# EAGLE design atx_power_control (EAGLE 9.6.1)
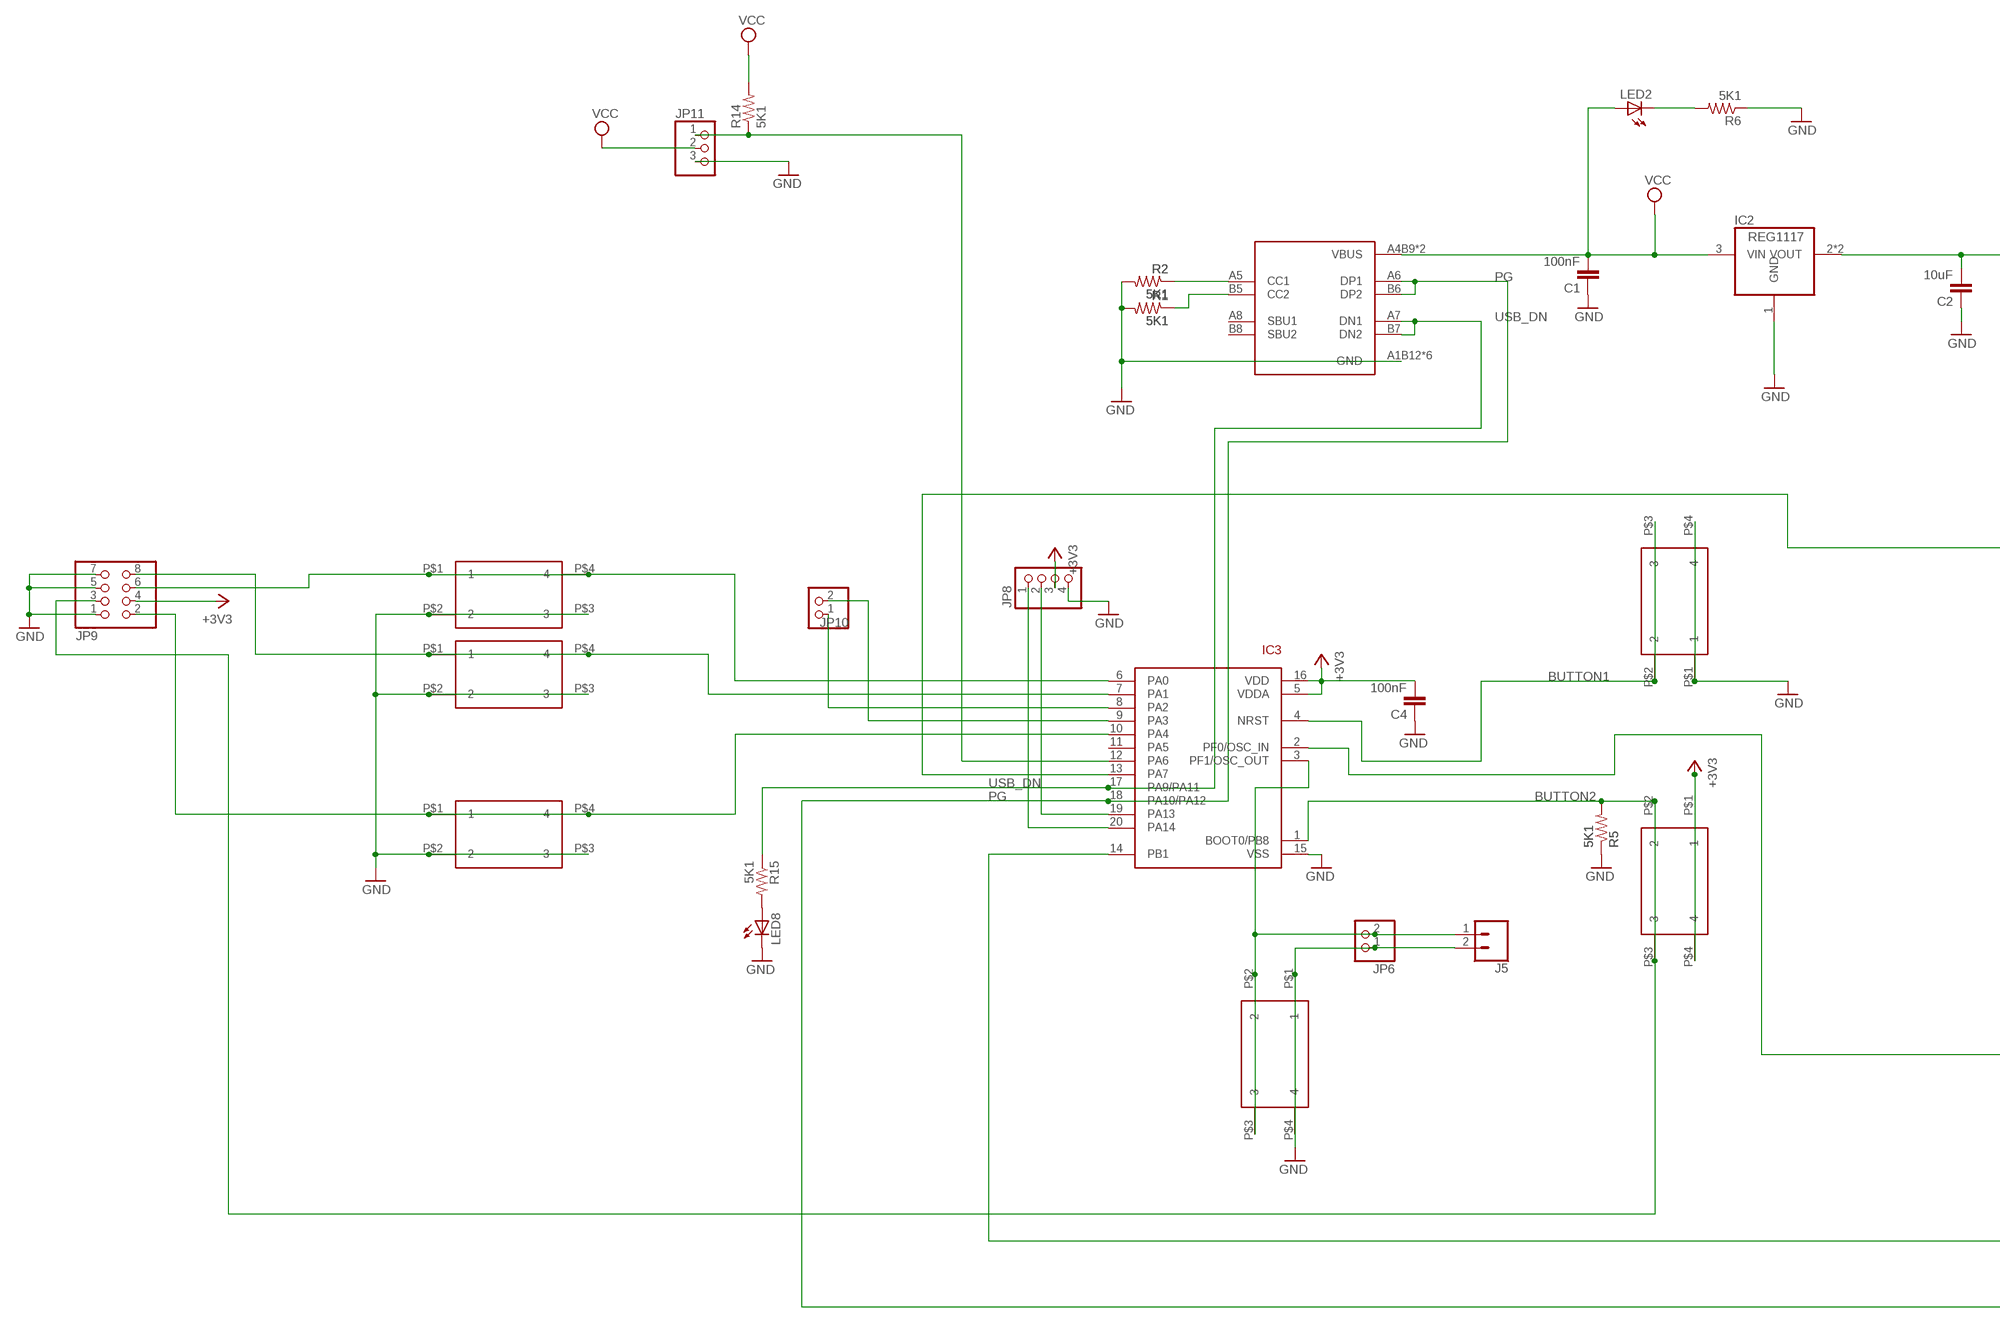
[diagram p0: schematic, sheet 1, part 1 of 2]
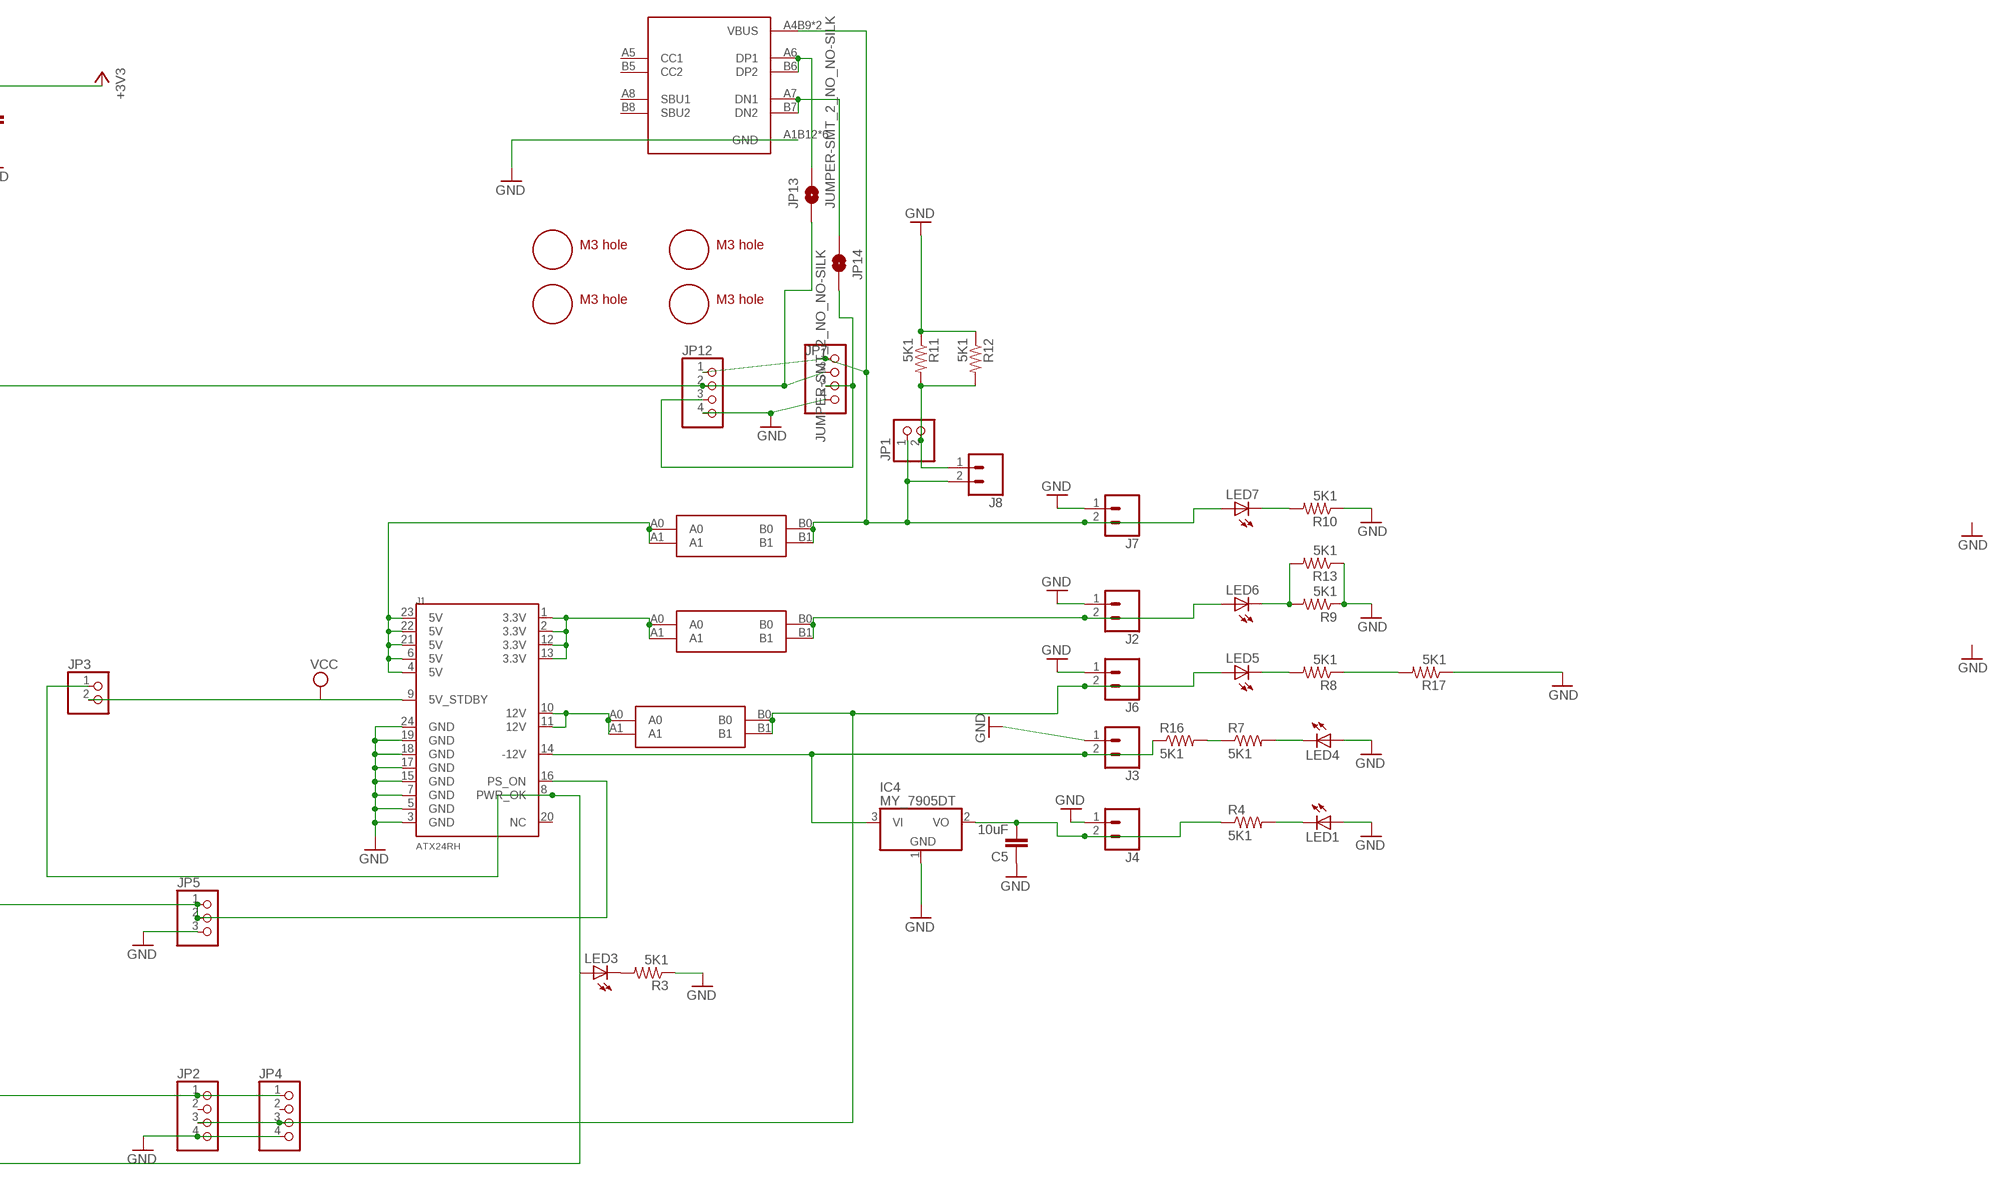
[diagram p1: schematic, sheet 1, part 2 of 2]

## Parts
C1  100nF  CAP0805  [0805$1]
C2  10uF  CAP0805  [0805$1]
C4  100nF  CAP0805  [0805$1]
C5  10uF  CAP0805  [0805$1]
IC2  REG1117  [SOT223]
IC3  STM32F042F4  [TSSOP20]
IC4  MY_7905DT  [ADAFRUIT_TO252]
J1  ATX24RH  [ATX24_RIGHT_ANGLE]
J2  CONN_023.5MM  [SCREWTERMINAL-3.5MM-2]
J3  CONN_023.5MM  [SCREWTERMINAL-3.5MM-2]
J4  CONN_023.5MM  [SCREWTERMINAL-3.5MM-2]
J5  CONN_023.5MM  [SCREWTERMINAL-3.5MM-2]
J6  CONN_023.5MM  [SCREWTERMINAL-3.5MM-2]
J7  CONN_023.5MM-NO_SILK  [SCREWTERMINAL-3.5MM-2-NS]
J8  CONN_023.5MM  [SCREWTERMINAL-3.5MM-2]
JP1  PINHD-1X2  [1X02]
JP2  PINHD-1X4  [1X04]
JP3  PINHD-1X2  [1X02]
JP4  PINHD-1X4  [1X04]
JP5  PINHD-1X3:1  [1X03]
JP6  PINHD-1X2  [1X02]
JP7  PINHD-1X6  [1X06]
JP8  PINHD-1X4  [1X04]
JP9  PINHD-2X4  [2X04]
JP10  PINHD-1X2  [1X02]
JP11  PINHD-1X3CB  [1X03-CLEANBIG]
JP12  PINHD-1X6  [1X06]
JP13  JUMPER-SMT_2_NO_NO-SILK  [SMT-JUMPER_2_NO_NO-SILK]
JP14  JUMPER-SMT_2_NO_NO-SILK  [SMT-JUMPER_2_NO_NO-SILK]
LED1  LEDCHIP-LED0805  [CHIP-LED0805]
LED2  LEDCHIP-LED0805  [CHIP-LED0805]
LED3  LEDCHIP-LED0805  [CHIP-LED0805]
LED4  LEDCHIP-LED0805  [CHIP-LED0805]
LED5  LEDCHIP-LED0805  [CHIP-LED0805]
LED6  LEDCHIP-LED0805  [CHIP-LED0805]
LED7  LEDCHIP-LED0805  [CHIP-LED0805]
LED8  LEDCHIP-LED0805  [CHIP-LED0805]
R1  5K1  RESISTOR0805-RES  [0805]
R2  5K1  RESISTOR0805-RES  [0805]
R3  5K1  RESISTOR0805-RES  [0805]
R4  5K1  RESISTOR0805-RES  [0805]
R5  5K1  RESISTOR0805-RES  [0805]
R6  5K1  RESISTOR0805-RES  [0805]
R7  5K1  RESISTOR0805-RES  [0805]
R8  5K1  RESISTOR0805-RES  [0805]
R9  5K1  RESISTOR0805-RES  [0805]
R10  5K1  RESISTOR0805-RES  [0805]
R11  5K1  RESISTOR0805-RES  [0805]
R12  5K1  RESISTOR0805-RES  [0805]
R13  5K1  RESISTOR0805-RES  [0805]
R14  5K1  RESISTOR0805-RES  [0805]
R15  5K1  RESISTOR0805-RES  [0805]
R16  5K1  RESISTOR0805-RES  [0805]
R17  5K1  RESISTOR0805-RES  [0805]
SW1  324_SW  [342_SWICH_FOOT]
SW2  324_SW  [342_SWICH_FOOT]
SW3  324_SW  [342_SWICH_FOOT]
SW4  324_SW  [342_SWICH_FOOT]
SW5  324_SW  [342_SWICH_FOOT]
SW7  324_SW  [342_SWICH_FOOT]
U1  USBC_16P  [USBC_16P_FOOT]
U2  USBC_16P  [USBC_16P_FOOT]
U$1  M3_MOUNTING_HOLE  [M3_MOUNTING_HOLE_PACK]
U$2  M3_MOUNTING_HOLE  [M3_MOUNTING_HOLE_PACK]
U$3  M3_MOUNTING_HOLE  [M3_MOUNTING_HOLE_PACK]
U$5  CAR_FUSE_HOLDER3IN1  [FUSE_HOLDER_3IN1]
U$7  CAR_FUSE_HOLDER3IN1  [FUSE_HOLDER_3IN1]
U$8  CAR_FUSE_HOLDER3IN1  [FUSE_HOLDER_3IN1]
U$10  M3_MOUNTING_HOLE  [M3_MOUNTING_HOLE_PACK]

## Nets
+3V3: C2.2 C4.2 IC2.2(VOUT) IC2.4(VOUT) IC3.5(VDDA) IC3.16(VDD) JP8.3 JP9.4 SW4.P$1 SW4.P$4
BUTTON1: IC3.4(NRST) SW3.P$2 SW3.P$3
BUTTON2: IC3.1(BOOT0/PB8) JP9.3 R5.2 SW4.P$2 SW4.P$3
GND: C1.1 C2.1 C4.1 C5.1 IC2.1(GND) IC3.15(VSS) IC4.1(GND) J1.3(GND) J1.5(GND) J1.7(GND) J1.15(GND) J1.17(GND) J1.18(GND) J1.19(GND) J1.24(GND) J2.1 J3.1 J4.1 J5.2 J6.1 J7.1 JP2.4 JP4.4 JP5.3 JP6.1 JP7.4 JP8.4 JP9.1 JP9.5 JP9.7 JP11.3 JP12.4 LED1.A LED4.A LED8.C R1.2 R2.2 R3.1 R5.1 R6.1 R9.1 R10.1 R11.1 R12.1 R13.1 R17.1 SW1.P$1 SW1.P$4 SW2.P$2 SW2.P$3 SW3.P$1 SW3.P$4 SW5.P$2 SW5.P$3 SW7.P$2 SW7.P$3 U1.A1B12(GND) U1.B11A12(GND) U1.P$13(GND) U1.P$14(GND) U1.P$15(GND) U1.P$16(GND) U2.A1B12(GND) U2.B11A12(GND) U2.P$13(GND) U2.P$14(GND) U2.P$15(GND) U2.P$16(GND)
N$1: LED3.C R3.2
N$2: IC4.3(VI) J1.14(-12V) J3.2 R16.1
N$3: IC3.20(PA14) JP8.1
N$4: IC3.19(PA13) JP8.2
N$5: LED1.C R4.2
N$6: IC3.12(PA6) JP11.1 R14.1
N$7: IC3.14(PB1) JP2.1 JP4.1
N$8: LED4.C R7.2
N$9: LED5.C R8.2
N$10: J1.4(5V) J1.6(5V) J1.21(5V) J1.22(5V) J1.23(5V) U$8.A0 U$8.A1
N$11: C5.2 IC4.2(VO) J4.2 R4.1
N$12: IC3.9(PA3) JP10.2
N$13: IC3.6(PA0) JP9.6 SW2.P$1 SW2.P$4
N$14: J1.1(3.3V) J1.2(3.3V) J1.12(3.3V) J1.13(3.3V) U$7.A0 U$7.A1
N$15: J6.2 JP2.3 JP4.3 LED5.A U$5.B0 U$5.B1
N$16: J2.2 LED6.A U$7.B0 U$7.B1
N$17: J8.1 JP1.2 R11.2 R12.2
N$18: LED6.C R9.2 R13.2
N$19: LED8.A R15.2
N$20: LED7.C R10.2
N$21: J1.10(12V) J1.11(12V) U$5.A0 U$5.A1
N$22: IC3.7(PA1) JP9.8 SW5.P$1 SW5.P$4
N$23: IC3.8(PA2) JP10.1
N$25: IC3.2(PF0/OSC_IN) J1.16(PS_ON) JP5.1 JP5.2
N$26: IC3.3(PF1/OSC_OUT) J5.1 JP6.2 SW1.P$2 SW1.P$3
N$27: IC3.10(PA4) JP9.2 SW7.P$1 SW7.P$4
N$28: R7.1 R16.2
N$29: LED2.C R6.2
N$30: J7.2 J8.2 JP1.1 JP7.1 JP12.1 LED7.A U1.A4B9(VBUS) U1.B4A9(VBUS) U$8.B0 U$8.B1
N$31: R1.1 U2.B5(CC2)
N$32: R8.1 R17.2
N$33: R2.1 U2.A5(CC1)
N$34: JP13.2 U1.A6(DP1) U1.B6(DP2)
N$35: IC3.13(PA7) JP7.2 JP12.2 JP13.1
N$36: JP14.1 U1.A7(DN1) U1.B7(DN2)
N$37: JP7.3 JP12.3 JP14.2
PG: IC3.18(PA10/PA12) J1.8(PWR_OK) JP3.1 LED3.A U2.A6(DP1) U2.B6(DP2)
USB_DN: IC3.17(PA9/PA11) R15.1 U2.A7(DN1) U2.B7(DN2)
VCC: C1.2 IC2.3(VIN) J1.9(5V_STDBY) JP3.2 JP11.2 LED2.A R14.2 U2.A4B9(VBUS) U2.B4A9(VBUS)
Unconnected: IC3.11(PA5) J1.20(NC) JP2.2 JP4.2 U1.A5(CC1) U1.A8(SBU1) U1.B5(CC2) U1.B8(SBU2) U2.A8(SBU1) U2.B8(SBU2)

## Library data of the parts
C1 C2 C4 C5 = atx_power_control:CAP: Capacitor Standard 0603 ceramic capacitor, and 0.1" leaded capacitor.
IC2 = atx_power_control:REG1117: 800mA and 1A Low Dropout (LDO) Positive Regulator 1.8V, 2.5V, 2.85V, 3.3V, 5V, and Adj; MF: TEXAS INSTRUMENTS; MPN: REG1117FAKTTT; OC_FARNELL: 1296120; OC_NEWARK: 87H2562
IC3 = tx:STM32F042F4
IC4 = atx_power_control:MY_7905: Positive VOLTAGE REGULATOR Added bigger pads to the TO-92 package
J1 = SparkFun-Connectors:ATX24: ATX24 Pin Power Supply Connector This is a good connector for connecting a computer power supply to a PCB. It's massive, but provides many amps of power at 5V and 12V. SKU: PRT-09498
J2-J6 J8 = atx_power_control:CONN_02: Multi connection point. Often used as Generic Header-pin footprint for 0.1 inch spaced/style header connections On any of the 0.1 inch spaced packages, you can populate with these: Break Away Headers - Straight <https://www.sparkfun.com/products/116> (PRT-00116) Break Away Male Headers - Right Angle <https://www.sparkfun.com/products/553> (PRT-00553) Female Headers <https://www.sparkfun.com/products/115> (PRT-00115) Break Away Headers - Machine Pin <https://www.sparkfun.com/products/117> (PRT-00117) Break Away Female Headers - Swiss Machine Pin <https://www.sparkfun.com/products/743> (PRT-00743) For SCREWTERMINALS and SPRING TERMINALS visit here: Screw Terimnals on SparkFun.com <https://www.sparkfun.com/search/results?term=Screw+Terminals> (5mm/3.5mm/2.54mm spacing) This device is also useful as a general connection point to wire up your design to another part of your project. Our various solder wires solder well into these plated through hole pads. Hook-Up Wire - Assortment (Stranded, 22 AWG) <https://www.sparkfun.com/products/11375> (PRT-11375) Hook-Up Wire - Assortment (Solid Core, 22 AWG) <https://www.sparkfun.com/products/11367> (PRT-11367) View the entire wire category on our website here <https://www.sparkfun.com/categories/141> Special notes: Molex polarized connector foot print use with: PRT-08233 with associated crimp pins and housings. 2.54_SCREWTERM for use with PRT-10571. 3.5mm Screw Terminal footprints for PRT-08084 5mm Screw Terminal footprints for use with PRT-08432; PROD_ID: CONN-08399
J7 = atx_power_control:CONN_02: Multi connection point. Often used as Generic Header-pin footprint for 0.1 inch spaced/style header connections On any of the 0.1 inch spaced packages, you can populate with these: Break Away Headers - Straight <https://www.sparkfun.com/products/116> (PRT-00116) Break Away Male Headers - Right Angle <https://www.sparkfun.com/products/553> (PRT-00553) Female Headers <https://www.sparkfun.com/products/115> (PRT-00115) Break Away Headers - Machine Pin <https://www.sparkfun.com/products/117> (PRT-00117) Break Away Female Headers - Swiss Machine Pin <https://www.sparkfun.com/products/743> (PRT-00743) For SCREWTERMINALS and SPRING TERMINALS visit here: Screw Terimnals on SparkFun.com <https://www.sparkfun.com/search/results?term=Screw+Terminals> (5mm/3.5mm/2.54mm spacing) This device is also useful as a general connection point to wire up your design to another part of your project. Our various solder wires solder well into these plated through hole pads. Hook-Up Wire - Assortment (Stranded, 22 AWG) <https://www.sparkfun.com/products/11375> (PRT-11375) Hook-Up Wire - Assortment (Solid Core, 22 AWG) <https://www.sparkfun.com/products/11367> (PRT-11367) View the entire wire category on our website here <https://www.sparkfun.com/categories/141> Special notes: Molex polarized connector foot print use with: PRT-08233 with associated crimp pins and housings. 2.54_SCREWTERM for use with PRT-10571. 3.5mm Screw Terminal footprints for PRT-08084 5mm Screw Terminal footprints for use with PRT-08432; PROD_ID: CONN-13512; SF_ID: PRT-09918; SF_SKU: PRT-08432; SKU: PRT-09914
JP1 JP3 JP10 = pinhead:PINHD-1X2: PIN HEADER
JP2 JP4 JP8 = atx_power_control:PINHD-1X4: PIN HEADER
JP5 = atx_power_control:PINHD-1X3*?:1: PIN HEADER
JP6 = atx_power_control:PINHD-1X2: PIN HEADER
JP7 JP12 = atx_power_control:PINHD-1X6: PIN HEADER
JP9 = atx_power_control:PINHD-2X4: PIN HEADER
JP11 = atx_power_control:PINHD-1X3: PIN HEADER
JP13 JP14 = SparkFun-Jumpers:JUMPER-SMT_2_NO: Normally open jumper This jumper has two pads in close proximity to each other. Apply solder to close the connection. Round pads are easier to solder for beginners, but are a lot larger. SparkFun Product that uses the round pads: SparkFun EL Sequencer <https://www.sparkfun.com/products/12781>
LED1-LED8 = adafruit:LED: LED OSRAM: - CHIPLED LG R971, LG N971, LY N971, LG Q971, LY Q971, LO R971, LY R971 LH N974, LH R974 LS Q976, LO Q976, LY Q976 LO Q996 - Hyper CHIPLED LW Q18S LB Q993, LB Q99A, LB R99A - SideLED LS A670, LO A670, LY A670, LG A670, LP A670 LB A673, LV A673, LT A673, LW A673 LH A674 LY A675 LS A676, LA A676, LO A676, LY A676, LW A676 LS A679, LY A679, LG A679 - Hyper Micro SIDELED® LS Y876, LA Y876, LO Y876, LY Y876 LT Y87S - SmartLED LW L88C, LW L88S LB L89C, LB L89S, LG L890 LS L89K, LO L89K, LY L89K LS L896, LA L896, LO L896, LY L896 - TOPLED LS T670, LO T670, LY T670, LG T670, LP T670 LSG T670, LSP T670, LSY T670, LOP T670, LYG T670 LG T671, LOG T671, LSG T671 LB T673, LV T673, LT T673, LW T673 LH T674 LS T676, LA T676, LO T676, LY T676, LB T676, LH T676, LSB T676, LW T676 LB T67C, LV T67C, LT T67C, LS T67K, LO T67K, LY T67K, LW E67C LS E67B, LA E67B, LO E67B, LY E67B, LB E67C, LV E67C, LT E67C LW T67C LS T679, LY T679, LG T679 LS T770, LO T770, LY T770, LG T770, LP T770 LB T773, LV T773, LT T773, LW T773 LH T774 LS E675, LA E675, LY E675, LS T675 LS T776, LA T776, LO T776, LY T776, LB T776 LHGB T686 LT T68C, LB T68C - Hyper Mini TOPLED® LB M676 - Mini TOPLED Santana® LG M470 LS M47K, LO M47K, LY M47K Source: http://www.osram.convergy.de/
R1-R3 R5 R6 R8-R15 R17 = atx_power_control:RESISTOR: Resistor Basic schematic elements and footprints for 0603, 1206, and PTH resistors.
R4 R7 R16 = SparkFun-Passives:RESISTOR: Resistor Basic schematic elements and footprints for 0603, 1206, and PTH resistors.
SW1-SW5 SW7 = 3pos_slide_switch_centered:324_SW
U1 U2 = my_usbc_16p:USBC_16P
U$1-U$3 U$10 = a:M3_MOUNTING_HOLE
U$5 U$7 U$8 = atx_power_control:CAR_FUSE_HOLDER

## Board
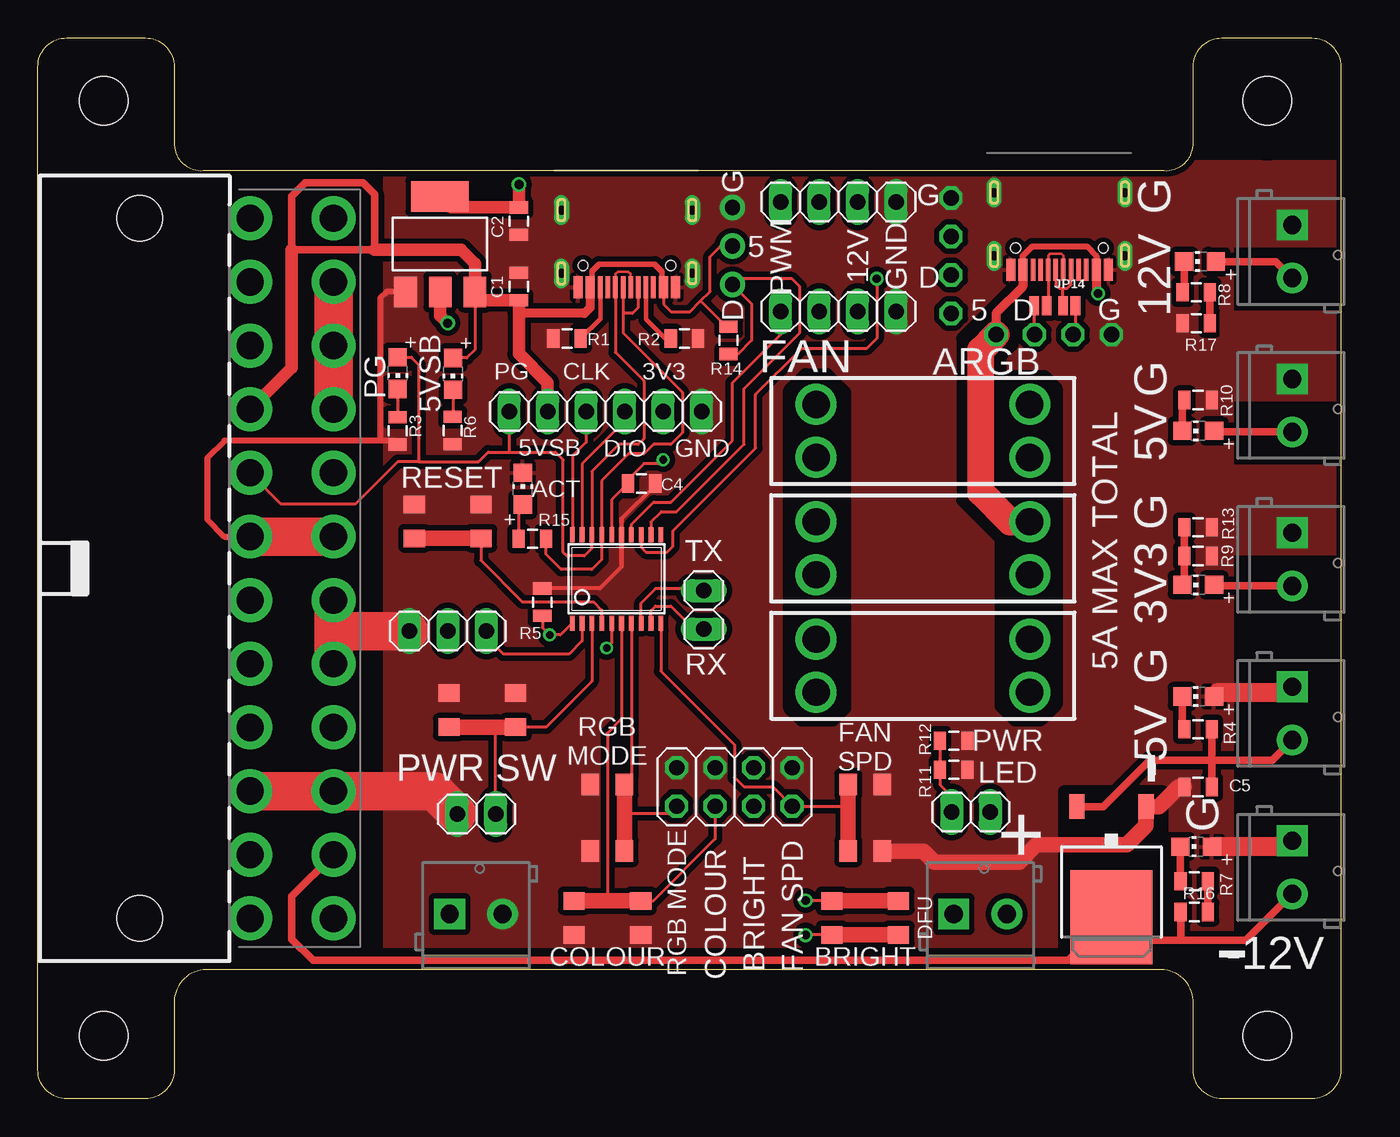
[diagram p2: board, top side]
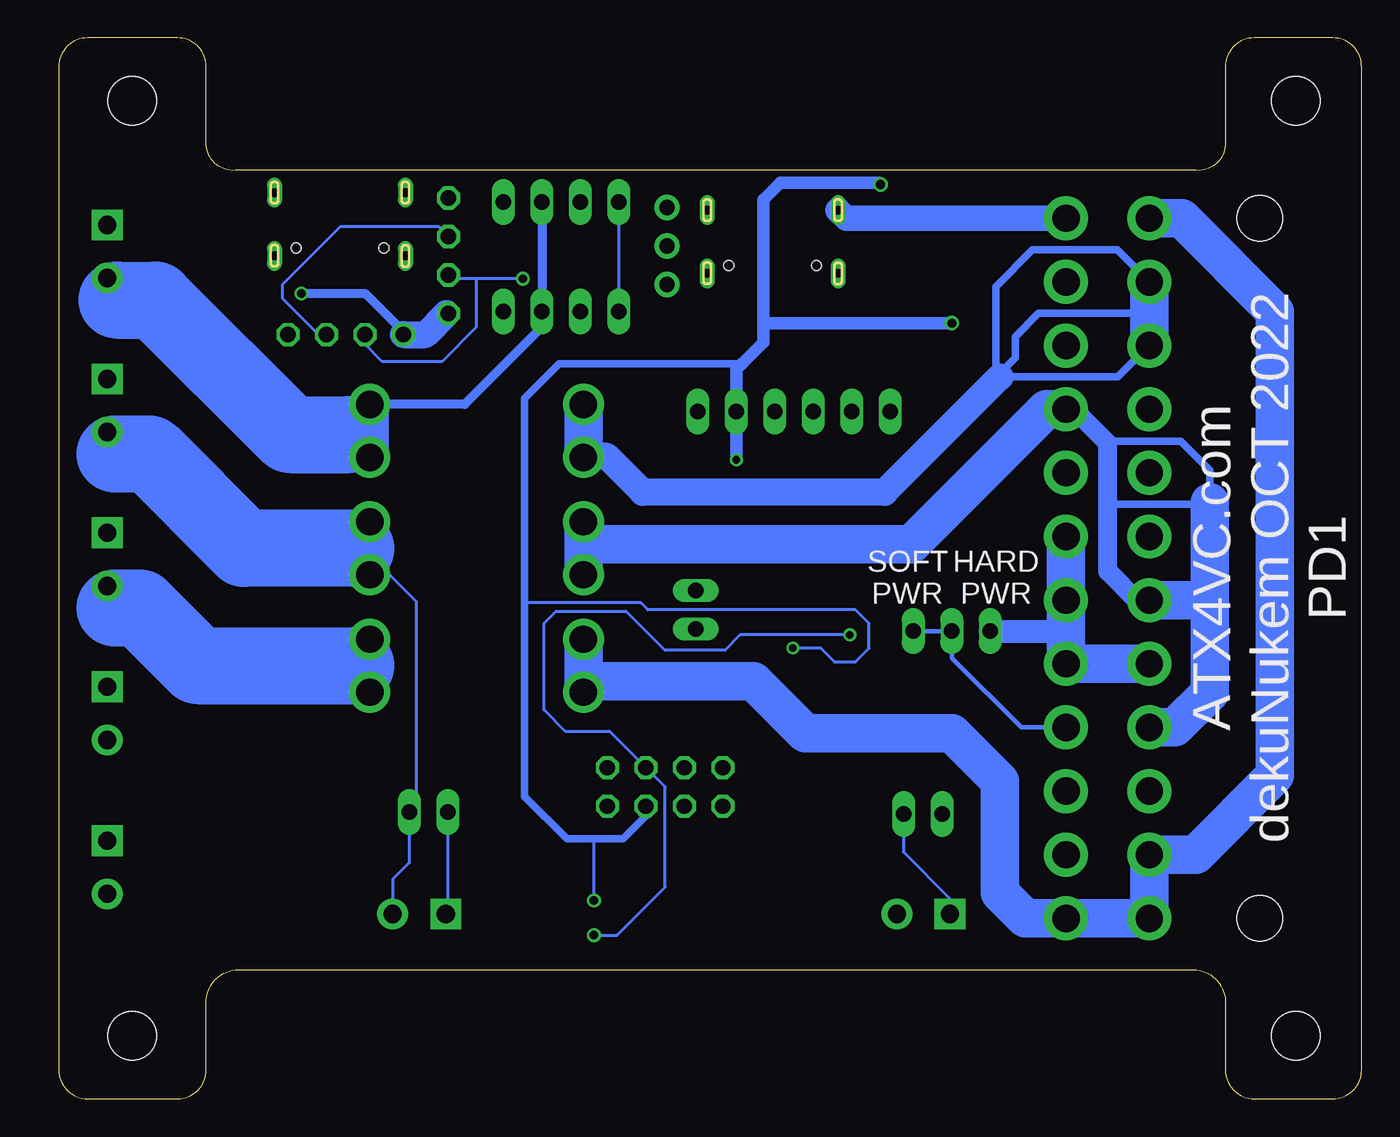
[diagram p3: board, bottom side, seen from below]

Size 86 x 70 mm. Coordinates in mm from the lower left corner, seen from the top.
Outline: 76.25,1.91 76.25,6.09 arc90 74.35,8.51 10.9,8.51 arc90 9,6.09 9,1.91 arc-90 7.09,0 1.91,0 arc-90 0,1.91 0,68.09 arc-90 1.91,70 7.09,70 arc-90 9,68.09 9,62.91 arc90 10.9,61.25 74.35,61.25 arc90 76.25,62.91 76.25,68.09 arc-90 78.16,70 84.09,70 arc-90 86,68.09 86,1.91 arc-90 84.09,0 78.16,0 arc-90 76.25,1.91
Copper layers (1*16): Top 0.035mm / dielectric 1.5mm / Bottom 0.035mm
Design rules "deku_2layer_6mil": minimum track width 6mil, minimum drill 15mil, track to track 6mil, track to pad 6mil, pad to pad 6mil, via to via 6mil, smd to smd 6mil, copper to edge 10mil, drill to drill 6mil, minimum pad ring 7mil, minimum via ring 7mil, stop-mask expansion 4mil, vias tented up to drill 25mil, thermal gap 10mil
tRestrict: area 0.3,0.2 to 8.3,8.2; area 0.3,61.8 to 8.3,69.8; area 77.2,61.9 to 85.2,69.9; area 77.2,0.2 to 85.2,8.2; area 67.7,7.5 to 74.3,20.3; area 49.7,25 to 53.2,47.8; area 63.6,25 to 67.2,47.6; area 61.1,37 to 65.4,51.4; area 62.4,50.7 to 65.4,54.2
bRestrict: area 0.3,0.2 to 8.3,8.2; area 77.2,0.2 to 85.2,8.2; area 0.3,61.8 to 8.3,69.8; area 77.2,61.9 to 85.2,69.9

### Footprints (pad centres in the part's own frame; a part is rotated, then mirrored left to right if it is on the bottom)
0805$1 = smd 0.8 x 1.2: 1 -0.9,0; 2 0.9,0
SOT223 = smd 1.499 x 2.007: 1 -2.261,-3.15; 2 0.025,-3.15; 3 2.311,-3.15 | smd 3.81 x 2.007: 4 0,3.15
TSSOP20 = smd 0.305 x 0.991: 1 -2.925,-2.918; 2 -2.275,-2.918; 3 -1.625,-2.918; 4 -0.975,-2.918; 5 -0.325,-2.918; 6 0.325,-2.918; 7 0.975,-2.918; 8 1.625,-2.918; 9 2.275,-2.918; 10 2.925,-2.918; 11 2.925,2.918; 12 2.275,2.918; 13 1.625,2.918; 14 0.975,2.918; 15 0.325,2.918; 16 -0.325,2.918; 17 -0.975,2.918; 18 -1.625,2.918; 19 -2.275,2.918; 20 -2.925,2.918
ADAFRUIT_TO252 = smd 1 x 1.6: 1 -2.28,-4.8; 2 2.28,-4.8 | smd 5.4 x 6.2: 3 0,2.5
ATX24_RIGHT_ANGLE = drill 1.8 pad 2.9: 1 23.1,4.76; 2 18.9,4.76; 3 14.7,4.76; 4 10.5,4.76; 5 6.3,4.76; 6 2.1,4.76; 7 -2.1,4.76; 8 -6.3,4.76; 9 -10.5,4.76; 10 -14.7,4.76; 11 -18.9,4.76; 12 -23.1,4.76; 13 23.1,10.26; 14 18.9,10.26; 15 14.7,10.26; 16 10.5,10.26; 17 6.3,10.26; 18 2.1,10.26; 19 -2.1,10.26; 20 -6.3,10.26; 21 -10.5,10.26; 22 -14.7,10.26; 23 -18.9,10.26; 24 -23.1,10.26 | hole 3: -23.1,-2.54; 23.1,-2.54
SCREWTERMINAL-3.5MM-2 = drill 1.2 pad 2.032 square: 1 0,0 | drill 1.2 pad 2.032: 2 3.5,0
SCREWTERMINAL-3.5MM-2-NS = drill 1.2 pad 2.032 square: 1 0,0 | drill 1.2 pad 2.032: 2 3.5,0
1X02 = drill 1.016 long: 1 -1.27,0; 2 1.27,0
1X04 = drill 1.016 long: 1 -3.81,0; 2 -1.27,0; 3 1.27,0; 4 3.81,0
1X03 = drill 1.016 long: 1 -2.54,0; 2 0,0; 3 2.54,0
1X06 = drill 1.016 octagon: 1 -6.35,0; 2 -3.81,0; 3 -1.27,0; 4 1.27,0
2X04 = drill 1.016 octagon: 1 -3.81,-1.27; 2 -3.81,1.27; 3 -1.27,-1.27; 4 -1.27,1.27; 5 1.27,-1.27; 6 1.27,1.27; 7 3.81,-1.27; 8 3.81,1.27
1X03-CLEANBIG = drill 1.016 pad 1.676: 1 -2.54,0; 2 0,0; 3 2.54,0
SMT-JUMPER_2_NO_NO-SILK = smd 0.635 x 1.27: 1 -0.406,0; 2 0.406,0
CHIP-LED0805 = smd 1.2 x 1.2: A 0,-1.05; C 0,1.05
0805 = smd 0.8 x 1.2: 1 -0.9,0; 2 0.9,0
342_SWICH_FOOT = smd 1.4 x 1.15: P$1 -2.2,-1.125; P$2 -2.2,1.125; P$3 2.2,1.125; P$4 2.2,-1.125
USBC_16P_FOOT = smd 0.6 x 1.45: A1B12 -3.225,3.848; A4B9 -2.425,3.848; B4A9 2.425,3.848; B11A12 3.225,3.848 | smd 0.3 x 1.45: A5 -1.25,3.848; A6 -0.25,3.848; A7 0.25,3.848; A8 1.25,3.848; B5 1.75,3.848; B6 0.75,3.848; B7 -0.75,3.848; B8 -1.75,3.848 | drill 0.6 pad 1 long: P$13 -4.32,2.933; P$14 4.32,2.933; P$15 -4.32,-1.248; P$16 4.32,-1.248 | hole 0.65: -2.89,2.402; 2.89,2.402
M3_MOUNTING_HOLE_PACK = hole 3.2: 0,0
FUSE_HOLDER_3IN1 = drill 1.8: A0 -7.05,1.75; A1 -7.05,-1.75; B0 7.05,1.75; B1 7.05,-1.75

### Placement (x,y rotation side)
C1  31.75,53.59 270 top
C2  31.75,57.91 90 top
C4  39.85,40.6 180 top
C5  76.58,20.57 0 top
IC2  26.53,56.39 0 top
IC3  38.2,34.3 0 top
IC4  70.87,14.48 180 top
J1  9.25,35 270 top
J2  82.8,37.34 270 top
J3  82.8,17.02 270 top
J4  82.8,27.18 270 top
J5  27.18,12.19 0 top
J6  82.8,57.66 270 top
J7  82.8,47.5 270 top
J8  60.45,12.19 0 top
JP1  61.59,18.92 180 top
JP2  52.83,51.94 0 top
JP3  32.38,45.34 0 top
JP4  52.83,59.18 0 top
JP5  27.05,30.86 180 top
JP6  28.96,18.8 0 top
JP7  69.6,50.42 0 top
JP8  40.01,45.34 0 top
JP9  45.97,20.57 180 top
JP10  43.94,32.26 270 top
JP11  45.85,56.26 90 top
JP12  60.27,58.17 90 top
JP13  66.17,52.32 0 top
JP14  68.07,52.32 0 top
LED1  76.58,26.54 90 top
LED2  27.4,47.83 180 top
LED3  23.75,47.88 180 top
LED4  76.45,16.64 90 top
LED5  76.71,55.24 90 top
LED6  76.58,33.91 90 top
LED7  76.58,44.07 90 top
LED8  32,40.26 0 top
R1  34.92,50.16 180 top
R2  42.67,50.16 0 top
R3  23.75,44.07 90 top
R4  76.58,24.38 180 top
R5  33.3,32.77 270 top
R6  27.38,44.09 90 top
R7  76.33,14.35 180 top
R8  76.45,53.21 180 top
R9  76.58,35.81 180 top
R10  76.58,46.1 180 top
R11  60.45,21.72 180 top
R12  60.45,23.62 180 top
R13  76.58,37.72 180 top
R14  45.59,50.04 90 top
R15  32.64,36.96 180 top
R16  76.33,12.32 0 top
R17  76.45,51.18 0 top
SW1  29.34,25.65 180 top
SW2  37.59,11.94 180 top
SW3  27.05,38.1 180 top
SW4  54.61,11.94 180 top
SW5  37.59,18.54 90 top
SW7  54.61,18.54 270 top
U1  67.44,58.55 180 top
U2  38.88,57.39 180 top
U$1  81.15,4.14 0 top
U$2  4.35,65.86 0 top
U$3  81.15,65.86 0 top
U$5  58.42,44.07 0 top
U$7  58.42,28.57 0 top
U$8  58.42,36.32 0 top
U$10  4.35,4.14 0 top

### Tracks (layer width: path | path; a pad name or v marks a point on that pad's centre or on a via)
+3V3  (via drill 0.5, 0.55, 0.6)
  Top 0.203: v41.27,42.16 41.02,41.91 40.01,41.91 38.95,40.86 C4.2 37.87,39.52 IC3.16 | SW4.P$4 50.69,13.06 v50.67,13.08 | IC3.5 37.87,30.07 v37.54,29.74
  Top 0.813: IC2.4 27.26,58.81 C2.2 v31.75,60.33 | IC2.2 26.56,51.67 v27.05,51.18
  Top 1.016: SW4.P$4 SW4.P$1
  Bottom 0.203: v50.67,13.08 50.67,17.14 | v37.54,29.74 35.71,29.74 34.8,28.83 33.4,28.83 32.51,29.72 32.51,31.37 33.4,32.26 47.12,32.26 47.57,32.72 55.24,32.72 55.24,32.64
  Bottom 0.508: 40.89,48.51 52.96,48.51 55.24,46.23 55.24,32.64 55.24,19.94 52.45,17.14 50.67,17.14 48.77,17.14 47.24,18.67 JP9.4
  Bottom 0.813: v31.75,60.33 31.88,60.45 38.35,60.45 39.5,59.31 39.5,51.31 | 39.5,51.31 39.5,49.91 40.89,48.51 41.27,48.13 JP8.3 v41.27,42.16 | v27.05,51.18 39.37,51.18 39.5,51.31
BUTTON1
  Top 0.203: IC3.4 37.22,32.25 36.7,32.77 32,32.77 29.25,35.52 SW3.P$2
  Top 1.016: SW3.P$2 SW3.P$3
BUTTON2  (via drill 0.5, 0.55)
  Top 0.203: IC3.1 34.49,30.61 v33.78,30.61 33.3,31.09 R5.2 | SW4.P$3 50.69,10.81 v50.67,10.79
  Top 1.016: SW4.P$3 SW4.P$2
  Bottom 0.203: v50.67,10.79 49.15,10.79 45.97,13.97 45.97,20.57 JP9.3 49.66,24.26 52.58,24.26 53.98,25.65 53.98,31.37 53.16,32.18 48.56,32.18 45.97,29.59 42.04,29.59 41.02,30.61 v33.78,30.61
GND
  Top 0.254: C4.1 40.75,40.5 38.52,38.27 | R5.1 37.1,33.67 38.52,35.09
  Top 0.305: 38.52,38.27 IC3.15 38.52,35.09
  Top 0.406: R3.1 23.48,43.43 22.61,43.43 | J1.7 12.3,37.1 11.18,38.23 11.18,42.29 12.32,43.43 22.61,43.43 | IC2.1 23,53.24 22.61,52.84 22.61,43.43
  Top 0.813: J4.1 82.42,26.8 | J3.1 82.42,16.64
  Top 1.016: C5.1 75.3,20.57 74,19.28 IC4.1 73.15,18.03 71.88,16.76 65.91,16.76 64.77,15.62 59.18,15.62 58.46,16.34 SW7.P$3
  Top 1.27: 82.42,26.8 77.89,26.8 LED1.A | 82.42,16.64 LED4.A
  Top 2.54: J1.7 J1.19 | J1.3 J1.15 26.18,20.3 JP6.1 | J1.18 19.51,30.61 | 19.51,30.61 J1.17 | 19.51,30.61 19.77,30.86 JP5.3
  Bottom 1.524: JP5.3 19.51,30.86
  Bottom 1.676: U2.P$16 34.02,58.1 J1.24
  Bottom 2.54: J1.5 J1.17 19.51,30.86 J1.18 J1.19
  pour Top (isolate 0.356): 22.86,10.03 78.89,10.03 78.89,61.87 22.86,61.87
  pour Top (no thermals): 78.11,51.94 86.11,51.94 86.11,46.1 78.11,46.1
  pour Top (no thermals): 77.47,61.85 86.11,61.85 86.11,56.26 77.47,56.26
  pour Top (no thermals): 77.09,41.78 86.11,41.78 86.11,35.94 77.09,35.94
N$1
  Top 0.203: LED3.C R3.2
N$2
  Top 0.508: J1.14 16.76,13.35 16.76,10.54 18.16,9.14 68.03,9.14 IC4.3 72.39,10.45 75.44,10.45 | 75.44,10.45 79.74,10.45 J3.2 | R16.1 75.43,10.46 75.44,10.45
N$3
  Top 0.203: JP8.1 36.2,43.31 35.31,42.42 35.31,37.26 IC3.20
N$4
  Top 0.203: JP8.2 38.73,44.7 35.92,41.89 IC3.19
N$5
  Top 0.508: LED1.C 75.53,24.53 R4.2
N$6
  Top 0.203: IC3.12 40.47,38.06 41.15,38.73 42.16,38.73 46.61,43.18 46.61,46.86 50.29,50.55 50.29,53.59 49.78,54.1 46.23,54.1 JP11.1 47.12,52.45 47.12,50.04 46.22,49.14 R14.1
N$7
  Top 0.203: IC3.14 39.17,37.9 40.64,39.37 41.78,39.37 45.85,43.43 45.85,47.24 49.02,50.42 JP2.1
  Bottom 0.203: JP2.1 JP4.1
N$8
  Top 0.508: LED4.C 75.4,14.37 R7.2
N$9
  Top 0.508: LED5.C 75.66,53.32 R8.2
N$10
  Top 2.54: J1.23 J1.22 J1.21
  Bottom 0.508: 16.76,39.24 10.03,39.24 10.03,39.37 10.03,41.48 11.94,43.38 16.89,43.38
  Bottom 1.27: J1.21 19.01,45.5 16.89,43.38 16.76,43.26 16.76,39.24 16.76,34.8 14.87,32.9 J1.6
  Bottom 2.54: J1.4 12.33,24.5 10.03,26.8 10.03,32.9 | J1.21 20.79,45.5 29.72,36.58 51.37,36.58 | 10.03,32.9 10.03,39.37 | 10.03,32.9 J1.6 | U$8.A0 51.37,36.58 | 51.37,36.58 U$8.A1
N$11
  Top 0.508: J4.2 81.48,22.35 77.48,22.35 | R4.1 77.48,22.35 | 77.48,22.35 73.41,22.35 70.33,19.28 IC4.2 | C5.2 77.48,22.35
N$12
  Top 0.203: IC3.9 40.47,32.22 40.77,32.51 41.78,32.51 43.31,30.99 JP10.2
N$13
  Top 0.203: IC3.6 38.52,25.06 37.59,24.13 37.59,13.06 | JP9.6 44.7,17.14 40.62,13.06 SW2.P$1
  Top 1.016: SW2.P$4 37.59,13.06 SW2.P$1
N$14
  Bottom 2.54: J1.12 11.87,58.1 5.71,51.94 5.71,21.34 10.95,16.1 J1.2 J1.1 J1.13 22.19,11.9 23.88,13.59 23.88,20.95 27.05,24.13 36.7,24.13 40.13,27.56 51.37,27.56 | 51.37,27.56 U$7.A1 | U$7.A0 51.37,27.56
N$15
  Top 0.508: LED5.A 81.72,55.24 J6.2
  Bottom 0.203: 66.8,43.7 66.8,43.65 U$5.B1
  Bottom 0.508: JP2.3 54.1,50.93
  Bottom 0.61: 54.1,50.93 59.21,45.82 U$5.B0 | JP4.3 JP2.3
  Bottom 0.813: J6.2 82.8,53.34 82.17,52.7
  Bottom 1.778: 66.8,43.81 66.8,43.7
  Bottom 2.54: U$5.B1 U$5.B0
  Bottom 5.08: 82.17,52.7 79.63,52.7 70.74,43.81 66.8,43.81
N$16
  Top 0.508: J2.2 77.7,33.84 LED6.A
  Bottom 0.813: 82.3,32.38 82.3,33.33 J2.2
  Bottom 1.778: U$7.B0 U$7.B1 65.47,27.65 66.4,28.57
  Bottom 5.08: 82.3,32.38 80.64,32.38 76.83,28.57 66.4,28.57
N$17
  Top 0.203: R12.2 R11.2 59.55,20.71 60.33,19.94 JP1.2
  Bottom 0.203: JP1.2 60.33,12.32 J8.1
N$18
  Top 0.508: LED6.C 75.68,34.06 R9.2 R13.2
N$19
  Top 0.203: LED8.A 31.74,38.94 R15.2
N$20
  Top 0.508: LED7.C 75.53,45.95 R10.2
N$21
  Bottom 0.508: J1.10 16.09,47.62 23.88,47.62 24.13,47.62 | J1.11 16.12,56.01 21.72,56.01 24.13,53.59 24.13,47.62 | 24.13,47.62 22.86,48.9 22.86,50.29 21.34,51.82 14.01,51.82
  Bottom 1.778: 23.88,47.62 31.5,40.01 47.43,40.01 49.82,42.39 51.37,42.39
  Bottom 2.54: J1.11 14.01,51.82 J1.10 | U$5.A1 51.33,42.35 51.37,42.39 U$5.A0
N$22
  Top 0.203: IC3.7 39.17,21.2 SW5.P$4 | JP9.8 41.66,18.8 38.72,18.8
  Top 1.016: SW5.P$4 38.72,18.8 SW5.P$1
N$23
  Top 0.203: IC3.8 39.82,32.71 40.77,33.66 43.81,33.66 JP10.1
N$25
  Top 0.203: IC3.2 35.92,30.21 35.05,29.34 30.73,29.34 29.59,30.48 JP5.1
  Bottom 0.305: J1.16 22.47,24.5 27.05,29.08 JP5.2 JP5.1
N$26
  Top 0.203: SW1.P$2 33.55,24.53 36.57,27.55 IC3.3 | JP6.2 30.23,24.53
  Top 1.016: SW1.P$3 30.23,24.53 SW1.P$2
  Bottom 0.203: J5.1 27.18,13.21 30.23,16.26 JP6.2
N$27
  Top 0.203: IC3.10 41.12,28.22 45.97,23.37 45.97,21.21 46.61,20.57 48.51,20.57 JP9.2 53.48,19.3
  Top 1.016: SW7.P$1 53.48,19.3 SW7.P$4
N$28
  Top 0.508: R7.1 R16.2
N$29
  Top 0.203: LED2.C 27.4,45.01 R6.2
N$30  (via drill 0.55)
  Top 0.406: U1.B4A9 65.01,55.61 65.63,56.24 69.27,56.24 69.86,55.64 U1.A4B9
  Top 0.508: J7.2 77.7,44 LED7.A
  Top 0.61: U1.A4B9 69.86,53.25 v69.98,53.14 | JP7.1 63.25,51.82 65.01,53.58 U1.B4A9
  Top 1.778: U$8.B0 64.16,38.07 62.23,40.01 62.23,49.4 JP7.1
  Bottom 0.203: J8.2 63.95,14.48 62.87,15.56 JP1.1 62.38,19.41 62.38,32.8 64.15,34.57 U$8.B1 65.47,34.62 66.4,35.55 66.4,36.32
  Bottom 0.61: v69.98,53.14 65.79,53.14 63.25,50.6 JP7.1
  Bottom 0.813: J7.2 82.3,43.49 82.3,42.55
  Bottom 1.524: 60.4,51.82 JP12.1
  Bottom 1.778: JP7.1 61.8,50.42 60.4,51.82
  Bottom 2.54: U$8.B0 U$8.B1
  Bottom 5.08: 82.3,42.55 80.01,42.55 73.79,36.32 66.4,36.32
N$31
  Top 0.305: U2.B5 37.13,51.47 R1.1
N$32
  Top 0.508: R8.1 R17.2
N$33
  Top 0.305: U2.A5 40.13,51.44 41.4,50.16 R2.1
N$34
  Top 0.152: U1.B6 66.69,55.64 66.8,55.75 67.56,55.75 67.69,55.63 U1.A6
  Top 0.203: JP13.2 66.69,52.44 U1.B6
N$35  (via drill 0.55)
  Top 0.203: IC3.13 39.82,36.38 40.13,36.07 41.53,36.07 41.91,36.45 41.91,37.47 47.37,42.93 47.37,46.48 50.42,49.53 54.74,49.53 55.37,50.16 v55.37,54.1 | JP7.2 65.79,52.3 JP13.1
  Bottom 0.203: v55.37,54.1 58.42,54.1 | 58.42,54.1 60.02,54.1 JP12.2 | 58.42,54.1 58.42,50.93 60.71,48.64 64.64,48.64 65.79,49.78 JP7.2
N$36
  Top 0.203: U1.A7 67.19,53.72 67.44,53.47 67.69,53.47 | 67.69,53.47 67.94,53.47 68.2,53.72 68.2,54.69 U1.B7 | JP14.1 67.67,53.44 67.69,53.47
N$37
  Top 0.203: JP14.2 68.48,50.57 JP7.3
  Bottom 0.203: JP12.3 60.91,57.53 67.44,57.53 71.25,53.72 71.25,52.83 68.83,50.42 JP7.3
PG
  Top 0.152: U2.B6 38.13,54.43 38.28,54.59 38.96,54.59 39.13,54.42 U2.A6
  Top 0.203: U2.B6 38.13,49.25 40.01,47.37 40.01,43.56 39.62,43.18 38.35,43.18 36.57,41.4 IC3.18 36.57,36.32 36.07,35.81 34.92,35.81 34.67,36.07 34.67,42.16 34.16,42.67 31.11,42.67 | J1.8 16.07,39.24 20.95,39.24 23.75,42.04 25.15,42.04 | LED3.A 24.64,48.93 25.15,48.42 25.15,42.04 | 25.15,42.04 29.08,42.04 29.72,42.67 31.11,42.67 | JP3.1 31.11,42.67
USB_DN
  Top 0.203: U2.B7 39.63,52.2 39.24,51.82 38.63,51.82 U2.A7 38.63,50.53 42.55,46.61 42.55,43.94 41.78,43.18 40.64,43.18 40.01,42.55 38.99,42.55 37.22,40.78 IC3.17 37.22,35.57 36.58,34.92 34.54,34.92 33.54,35.93 R15.1
VCC
  Top 0.203: IC2.3 28.84,49.42 28.31,48.88 LED2.A | U2.A4B9 41.3,52.42 41.78,51.94 43.05,51.94 43.75,52.64 | JP11.2 45.06,56.26 44.37,55.58 44.37,53.26 43.75,52.64 | R14.2 45.45,50.94 43.75,52.64
  Top 0.356: U2.B4A9 36.58,53.67 36.58,54.61 37.03,55.07 40.72,55.07 41.2,54.59 41.2,53.65 U2.A4B9 | 29.39,52.69 IC2.3 | 31.88,51.82 31.75,51.94
  Top 0.508: 16.76,55.88 16.76,59.56 17.65,60.45 21.46,60.45 22.23,59.69 22.23,56.01 16.76,56.01
  Top 0.61: U2.B4A9 36.45,52.2 36.07,51.82 31.88,51.82
  Top 0.813: J1.9 16.76,48.25 16.76,55.88 16.76,56.01 | 22.23,56.01 27.94,56.01 28.84,55.1 IC2.3 | 29.39,52.69 C1.2 31.75,51.94 31.75,49.15 33.66,47.24 JP3.2

### Text on the board
tNames: G | G | G | 5 | PWM | 12V | GND | D | 12V | D | 5 | D | G | FAN | ARGB | PG | 5VSB | PG | CLK | 3V3 | G | 5V | 5VSB | DIO | GND | RESET | ACT | G | 5A MAX TOTAL | TX | 3V3 | RX | G | RGB / MODE | -5V | FAN / SPD | PWR / LED | PWR SW | G | + | RGB MODE | FAN SPD | COLOUR | BRIGHT | DFU | -12V | COLOUR | BRIGHT
bNames: ATX4VC.com / dekuNukem OCT 2022 / PD1 | HARD / PWR | SOFT / PWR